# Altium schematic sheet ETL_RB.SchDoc: ETL Readout Board
size A; DocumentNumber: 1; SheetNumber: 1; SheetTotal: 22
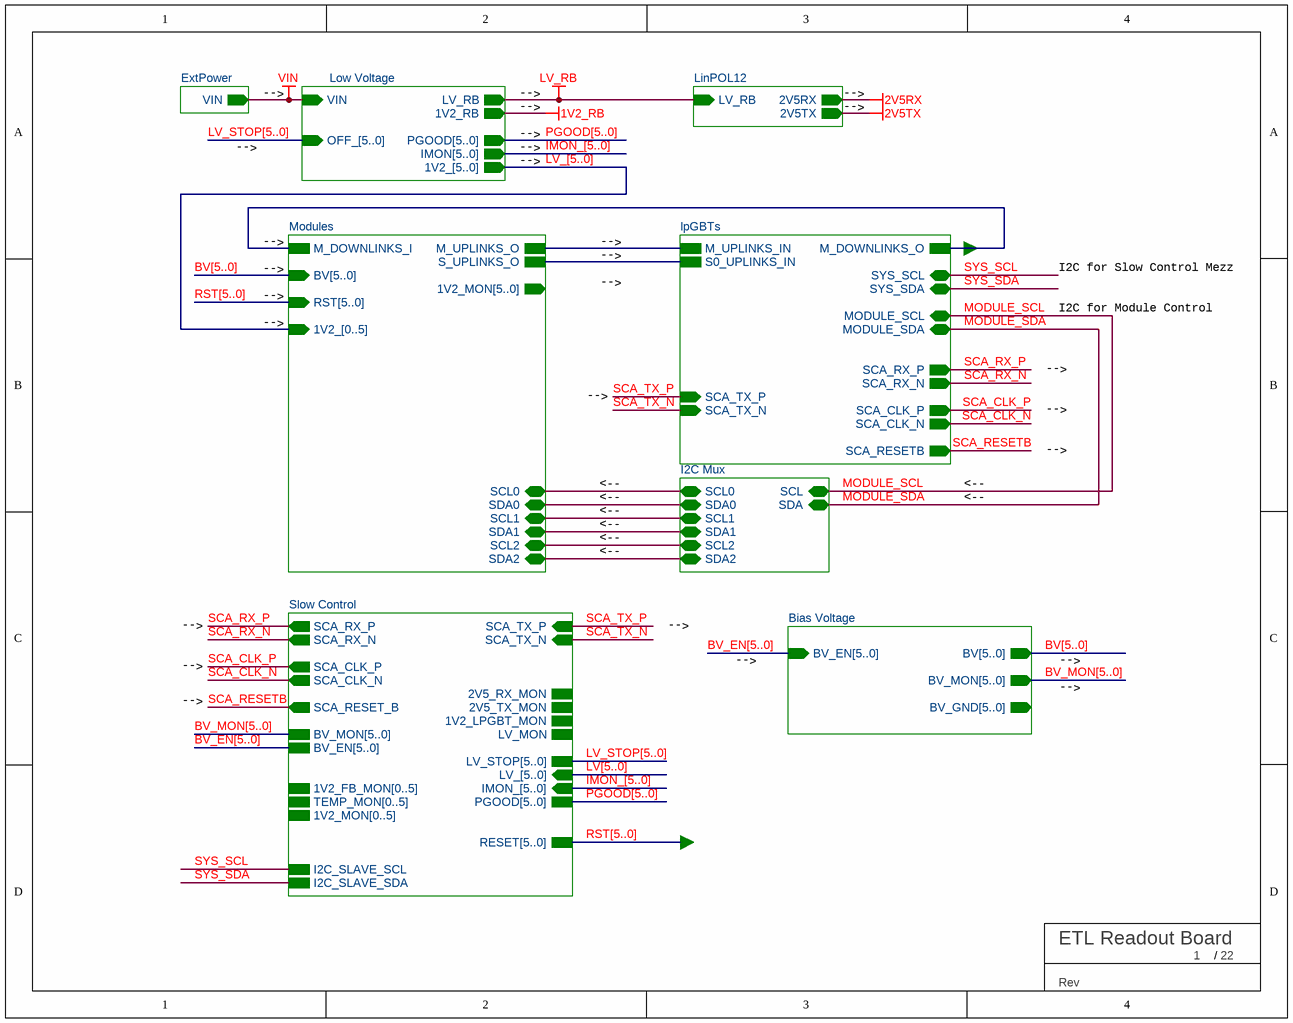
[diagram p0: ETL_RB.SchDoc]

## Parts
TBLOCK?  BU Title block  (value not drawn)  (graphical)

## Sub-sheets
Bias Voltage = BiasVoltage.SchDoc: BV_EN[5..0] (in), BV[5..0] (out), BV_GND[5..0] (out), BV_MON[5..0] (out)
ExtPower = ExtPower.SchDoc: VIN (out)
I2C Mux = I2C_Mux.SchDoc: SCL0 (bidir), SDA0 (bidir), SDA (bidir), SCL (bidir), SCL1 (bidir), SDA1 (bidir), SCL2 (bidir), SDA2 (bidir)
LinPOL12 = LinPOL12.SchDoc: 2V5RX (out), 2V5TX (out), LV_RB (in)
Low Voltage = LowVoltage.SchDoc: LV_RB (out), VIN (in), 1V2_RB (out), 1V2_[5..0] (out), IMON[5..0] (out), OFF_[5..0] (in), PGOOD[5..0] (out)
lpGBTs = lpGBTs.SchDoc: SCA_CLK_P (out), SCA_CLK_N (out), SCA_TX_N (in), SCA_TX_P (in), SYS_SCL (bidir), SCA_RX_N (out), M_UPLINKS_IN (harness UPLINK), M_DOWNLINKS_O (harness UPLINK), SCA_RX_P (out), SYS_SDA (bidir), S0_UPLINKS_IN (harness UPLINK), MODULE_SDA (bidir), MODULE_SCL (bidir), SCA_RESETB (out)
Modules = Modules.SchDoc: 1V2_MON[5..0] (out), BV[5..0] (in), SDA2 (bidir), SDA1 (bidir), SDA0 (bidir), SCL2 (bidir), SCL1 (bidir), RST[5..0] (in), SCL0 (bidir), M_UPLINKS_O (harness UPLINK), S_UPLINKS_O (harness UPLINK), M_DOWNLINKS_I (harness DOWNLINK), 1V2_[0..5] (in)
Slow Control = Slow-Control-Mezz.SchDoc: SCA_TX_N (in), SCA_RESET_B (out), SCA_TX_P (in), BV_MON[5..0], 1V2_MON[0..5], 2V5_RX_MON, SCA_CLK_P (out), SCA_CLK_N (out), SCA_RX_P (out), SCA_RX_N (out), BV_EN[5..0], RESET[5..0], LV_STOP[5..0], 2V5_TX_MON, LV_MON, TEMP_MON[0..5], 1V2_FB_MON[0..5], PGOOD[5..0], 1V2_LPGBT_MON, I2C_SLAVE_SCL, I2C_SLAVE_SDA, LV_[5..0] (in), IMON_[5..0] (in)

## Nets
1V2_RB: sheet Low Voltage/1V2_RB
2V5RX: sheet LinPOL12/2V5RX
2V5TX: sheet LinPOL12/2V5TX
LV_RB: sheet Low Voltage/LV_RB, sheet LinPOL12/LV_RB
VIN: sheet Low Voltage/VIN, sheet ExtPower/VIN
MODULE_SCL: sheet lpGBTs/MODULE_SCL, sheet I2C Mux/SCL
MODULE_SDA: sheet lpGBTs/MODULE_SDA, sheet I2C Mux/SDA
SCA_CLK_N: sheet Slow Control/SCA_CLK_N, sheet lpGBTs/SCA_CLK_N
SCA_CLK_P: sheet Slow Control/SCA_CLK_P, sheet lpGBTs/SCA_CLK_P
SCA_RESETB: sheet Slow Control/SCA_RESET_B, sheet lpGBTs/SCA_RESETB
SCA_RX_N: sheet Slow Control/SCA_RX_N, sheet lpGBTs/SCA_RX_N
SCA_RX_P: sheet Slow Control/SCA_RX_P, sheet lpGBTs/SCA_RX_P
SCA_TX_N: sheet Slow Control/SCA_TX_N, sheet lpGBTs/SCA_TX_N
SCA_TX_P: sheet Slow Control/SCA_TX_P, sheet lpGBTs/SCA_TX_P
SYS_SCL: sheet Slow Control/I2C_SLAVE_SCL, sheet lpGBTs/SYS_SCL
SYS_SDA: sheet Slow Control/I2C_SLAVE_SDA, sheet lpGBTs/SYS_SDA
(unnamed): sheet Modules/SDA2, sheet I2C Mux/SDA2
(unnamed): sheet Modules/SDA1, sheet I2C Mux/SDA1
(unnamed): sheet Modules/SDA0, sheet I2C Mux/SDA0
(unnamed): sheet Modules/SCL2, sheet I2C Mux/SCL2
(unnamed): sheet Modules/SCL1, sheet I2C Mux/SCL1
(unnamed): sheet Modules/SCL0, sheet I2C Mux/SCL0

## Buses and harness runs
bus BV[5..0] = sheet Bias Voltage/BV[5..0]
bus BV[5..0] = sheet Modules/BV[5..0]
bus BV_EN[5..0] = sheet Bias Voltage/BV_EN[5..0]
bus BV_EN[5..0] = sheet Slow Control/BV_EN[5..0]
bus BV_MON[5..0] = sheet Bias Voltage/BV_MON[5..0]
bus BV_MON[5..0] = sheet Slow Control/BV_MON[5..0]
bus IMON_[5..0] = sheet Low Voltage/IMON[5..0]
bus IMON_[5..0] = sheet Slow Control/IMON_[5..0]
bus LV[5..0] = sheet Slow Control/LV_[5..0]
bus LV_[5..0] = sheet Low Voltage/1V2_[5..0] = sheet Modules/1V2_[0..5]
bus LV_STOP[5..0] = sheet Low Voltage/OFF_[5..0]
bus LV_STOP[5..0] = sheet Slow Control/LV_STOP[5..0]
bus PGOOD[5..0] = sheet Low Voltage/PGOOD[5..0]
bus PGOOD[5..0] = sheet Slow Control/PGOOD[5..0]
bus RST[5..0] = sheet Modules/RST[5..0]
bus RST[5..0] = sheet Slow Control/RESET[5..0]

## Notes on the sheet
- <--
- I2C for Slow Control Mezz
- I2C for Module Control
- (in symbol TITLE_BLOCK_BU) /; Rev

## Library data of the parts
TBLOCK? = TITLE_BLOCK_BU